# Altium schematic sheet EthernetPort.SchDoc
size A4; SheetNumber: 6; SheetTotal: 7
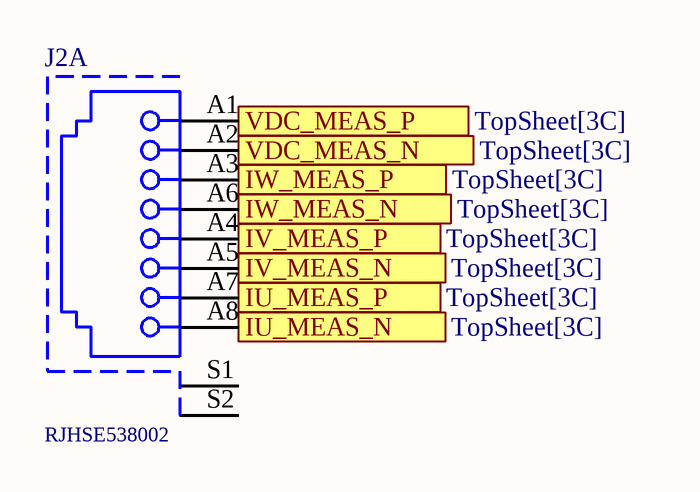
[diagram p0: EthernetPort.SchDoc]

## Parts
J2  RJHSE538002  [RJHSE-5380-02]  (part A of 2)

## Ports
IU_MEAS_N (in, see TopSheet[3C]), IU_MEAS_P (in, see TopSheet[3C]), IV_MEAS_N (in, see TopSheet[3C]), IV_MEAS_P (in, see TopSheet[3C]), IW_MEAS_N (in, see TopSheet[3C]), IW_MEAS_P (in, see TopSheet[3C]), VDC_MEAS_N (in, see TopSheet[3C]), VDC_MEAS_P (in, see TopSheet[3C])

## Nets
IU_MEAS_N: J2.A8 ; port IU_MEAS_N
IU_MEAS_P: J2.A7 ; port IU_MEAS_P
IV_MEAS_N: J2.A5 ; port IV_MEAS_N
IV_MEAS_P: J2.A4 ; port IV_MEAS_P
IW_MEAS_N: J2.A6 ; port IW_MEAS_N
IW_MEAS_P: J2.A3 ; port IW_MEAS_P
VDC_MEAS_N: J2.A2 ; port VDC_MEAS_N
VDC_MEAS_P: J2.A1 ; port VDC_MEAS_P

Not connected (* = marked no-connect by the designer): J2 S1 S2

## Library data of the parts
J2 = RJHSE538002: CAT5, RJ45 Connector, 1x2; Manufacturer: Amphenol; Created from: MGremer; Manufacturer Part Number: RJHSE538002; PartID: 4; Created On: 22/02/2021 16:43:38; ComponentLink1Description: Datasheet; ComponentLink1URL: https://www.farnell.com/cad/2360382.pdf; Component Type: RJ45 Connector; Device Package: RJ45; Last Updated: 22/02/2021 16:43:38; Mounting Type: THT; Series: RJHSE; Supplier 1: Farnell; Supplier Part Number 1: 1860605; Type: RJ45 Connector; Live Cycle Status: 1; Stock number: not stored